# Altium schematic sheet LED SCH.schdoc
size 127 x 101 mm
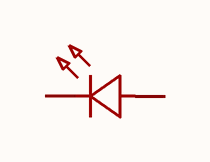
[diagram p0: LED SCH.schdoc]

## Parts
LED?  XL-1608SURC-06  [LED0603-RD_RED]  (value not drawn)

## Nets

Not connected (* = marked no-connect by the designer): LED? 1(K) 2(A)

## Library data of the parts
LED? = XL-1608SURC-06: Manufacturer: XINGLIGHT(成兴光); Add into BOM: yes; Illumination Color: Red; Voltage - Forward(Vf): 2.3V; Power(Watts): 50mW; Forward Current: 20mA; Wavelength - Dominant: 620nm~630nm; Peak Wavelength: 625nm; Lens Color: Colorless Transparent Lens; Luminous Intensity: 225mcd; Viewing Angle: 120°; Mounting Sytle: Positive Stick; Symbol: XL-1608SURC-06; Device: XL-1608SURC-06; LCSC Part Name: XL-1608SURC-06; Supplier Part: C965799; Manufacturer Part: XL-1608SURC-06; Supplier Footprint: 0603; JLCPCB Part Class: Extended Part; Datasheet: https://atta.szlcsc.com/upload/public/pdf/source/20250213/F9766CE804AF391355DCDD48DB3E0DAB.pdf; Supplier: LCSC; Convert to PCB: yes; Lamp Holder Type: -; Diode Configuration: -; Color Temperature: -; Operating Temperature: -20℃~+85℃